# Altium schematic sheet ZynqPeripherals.SchDoc: =TITLE
size A3; DocumentNumber: 9; SheetNumber: 9; SheetTotal: 11
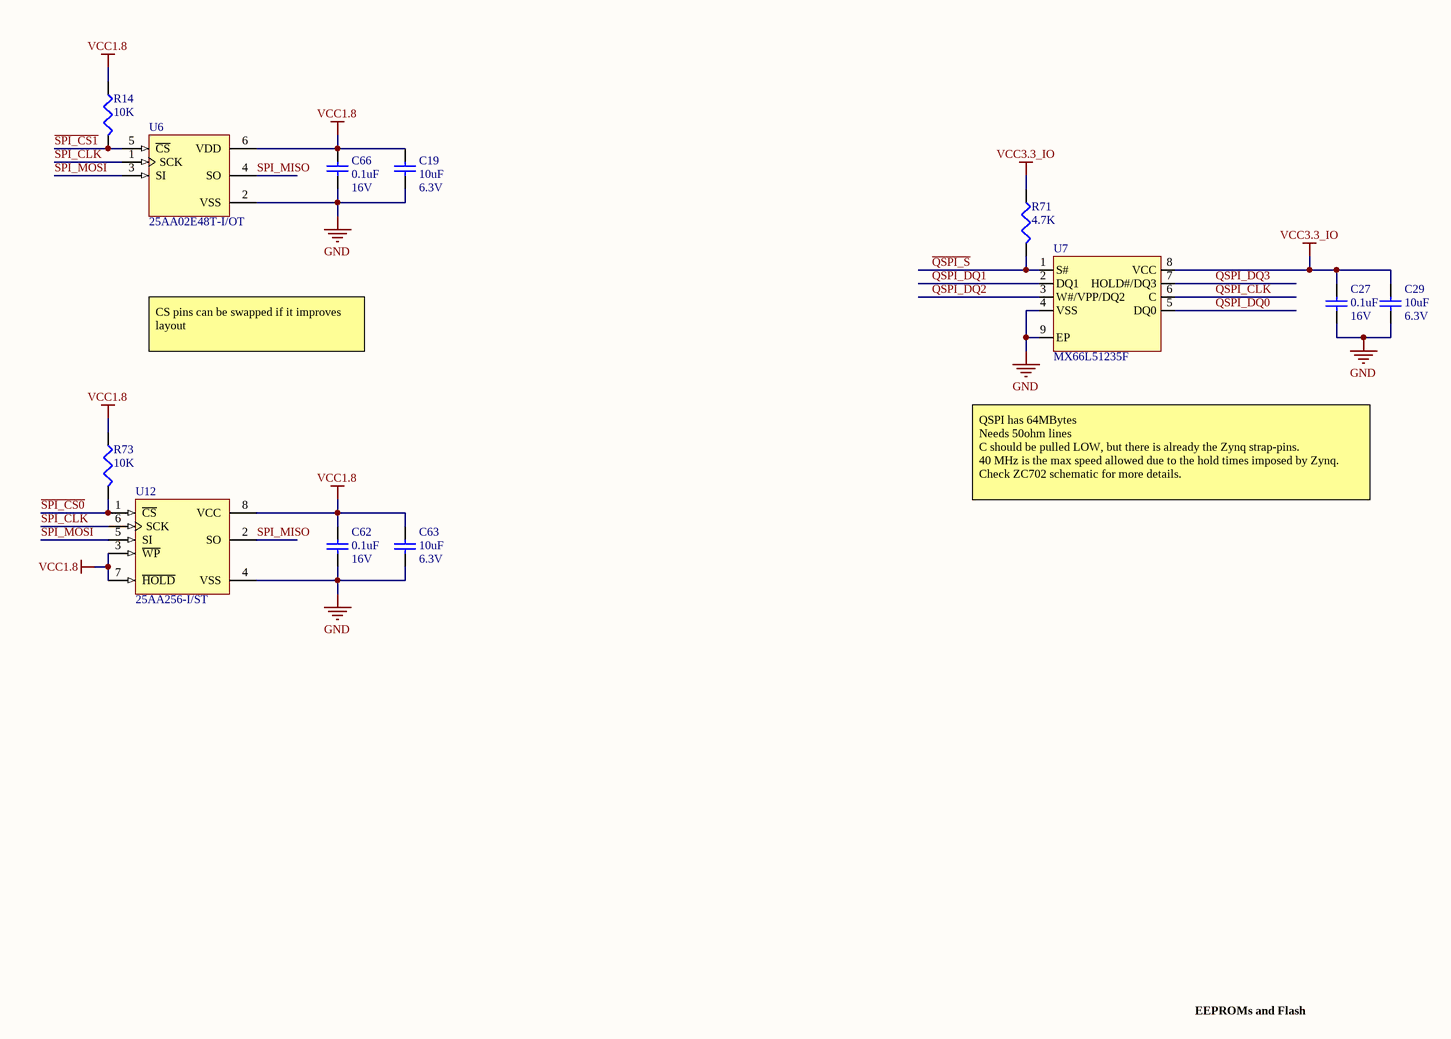
[diagram p0: ZynqPeripherals.SchDoc]

## Parts
C19  value 10uF  Rating: 6.3V  [C0402_IPC_H]  (hidden comment: ?)
C27  value 0.1uF  Rating: 16V  [C0402_IPC_H]  (hidden comment: ?)
C29  value 10uF  Rating: 6.3V  [C0402_IPC_H]  (hidden comment: ?)
C62  value 0.1uF  Rating: 16V  [C0402_IPC_H]  (hidden comment: ?)
C63  value 10uF  Rating: 6.3V  [C0402_IPC_H]  (hidden comment: ?)
C66  value 0.1uF  Rating: 16V  [C0402_IPC_H]  (hidden comment: ?)
R14  value 10K  [R0201_IPC_H]  (hidden comment: ?)
R71  value 4.7K  [R0402_IPC_H]  (hidden comment: ?)
R73  value 10K  [R0201_IPC_H]  (hidden comment: ?)
U6  25AA02E48T-I/OT  [SOT-23-OT6_L]
U7  MX66L51235F  [SON127P800X80_HS-9_N]
U12  25AA256-I/ST  [TSSOP-ST8_L]

## Nets
GND: C19.2 C27.2 C29.2 C62.2 C63.2 C66.2 U6.2(VSS) U7.4(VSS) U7.9(EP) U12.4(VSS)
VCC1.8: C19.1 C62.1 C63.1 C66.1 R14.1 R73.1 U6.6(VDD) U12.3(~{WP}) U12.7(~{HOLD}) U12.8(VCC)
VCC3.3_IO: C27.1 C29.1 R71.1 U7.8(VCC)
~{QSPI_S}: R71.2 U7.1(S#)
~{SPI_CS0}: R73.2 U12.1(~{CS})
~{SPI_CS1}: R14.2 U6.5(~{CS})
QSPI_CLK: U7.6(C)
QSPI_DQ0: U7.5(DQ0)
QSPI_DQ1: U7.2(DQ1)
QSPI_DQ2: U7.3(W#/VPP/DQ2)
QSPI_DQ3: U7.7(HOLD#/DQ3)
SPI_CLK: U6.1(SCK) U12.6(SCK)
SPI_MISO: U6.4(SO) U12.2(SO)
SPI_MOSI: U6.3(SI) U12.5(SI)

## Notes on the sheet
- CS pins can be swapped if it improves layout
- QSPI has 64MBytes
  Needs 50ohm lines
  C should be pulled LOW, but there is already the Zynq strap-pins.
  40 MHz is the max speed allowed due to the hold times imposed by Zynq.
  Check ZC702 schematic for more details.
- EEPROMs and Flash
- Description
- Title
- Size:
- Date:
- A3
- Number:
- Time:
- Revision:
- Sheet
- of
- File:
- Author:

## Library data of the parts
C19 C29 C63 = Cap: Capacitor; Manufacturer: Murata; Part: GRM155R60J106ME44D; INVKEY: CP0402-10UF-6V3-20%; PackageDescription: Chip Capacitor
C27 C62 C66 = Cap: Capacitor; Manufacturer: Murata; Part: GRM155R71C104KA88D; INVKEY: CP0402-0.1UF-16V-10%; PackageDescription: Chip Capacitor
R14 R73 = Res: Resistor; Manufacturer: Panasonic; Part: ERJ-1GNF1002C; Tolerance: 1%; INVKEY: RS0201-10K-1/20W-1%; PackageDescription: Chip Resistor
R71 = Res: Resistor; Manufacturer: Panasonic; Part: ERJ-2RKF4701X; Tolerance: 1%; INVKEY: RS0402-4K7-1/10W-1%; PackageDescription: Chip Resistor
U6 = CMP-0165-00270-1: 2K SPI Bus Serial EEPROM with EUI-48 Node Identity, 6-Pin SOT-23, Industrial Temperature, Tape and Reel; Manufacturer: Microchip; INVKEY: IC-EEPROM-2K-SSPI-SOT23; DatasheetVersion: revA, Dec-2008; PackageReference: SOT-23-OT6; PackageVersion: revBB, Aug-2009; PackageDescription: 6-Lead Plastic Small Outline Transistor (OT) [SOT-23]; Code_IPC: SOT26A-6; Part: 25AA02E48T-I/OT
U7 = MX66L51235F: 3V, 512M-bit [x1/x2/x4], CMOS MXSMIO (serial multi I/O) Flash Memory; Part: MX66L51235FZ2I-10G; Manufacturer: Macronix; INVKEY: ?
U12 = CMP-0165-00405-1: 256K SPI Bus Serial EEPROM, 8-Pin TSSOP, Industrial Temperature; Manufacturer: Microchip; INVKEY: IC-EEPROM-256K; Code_JEDEC: MO-153; DatasheetVersion: revF, May-2007; PackageDescription: 8-Lead Plastic Thin Shrink Small Outline (ST) - 4.4mm Body [TSSOP]; PackageReference: TSSOP-ST8; PackageVersion: revBB, Aug-2009; Part: 25AA256-I/ST